# Altium schematic sheet Control.SchDoc
size A4
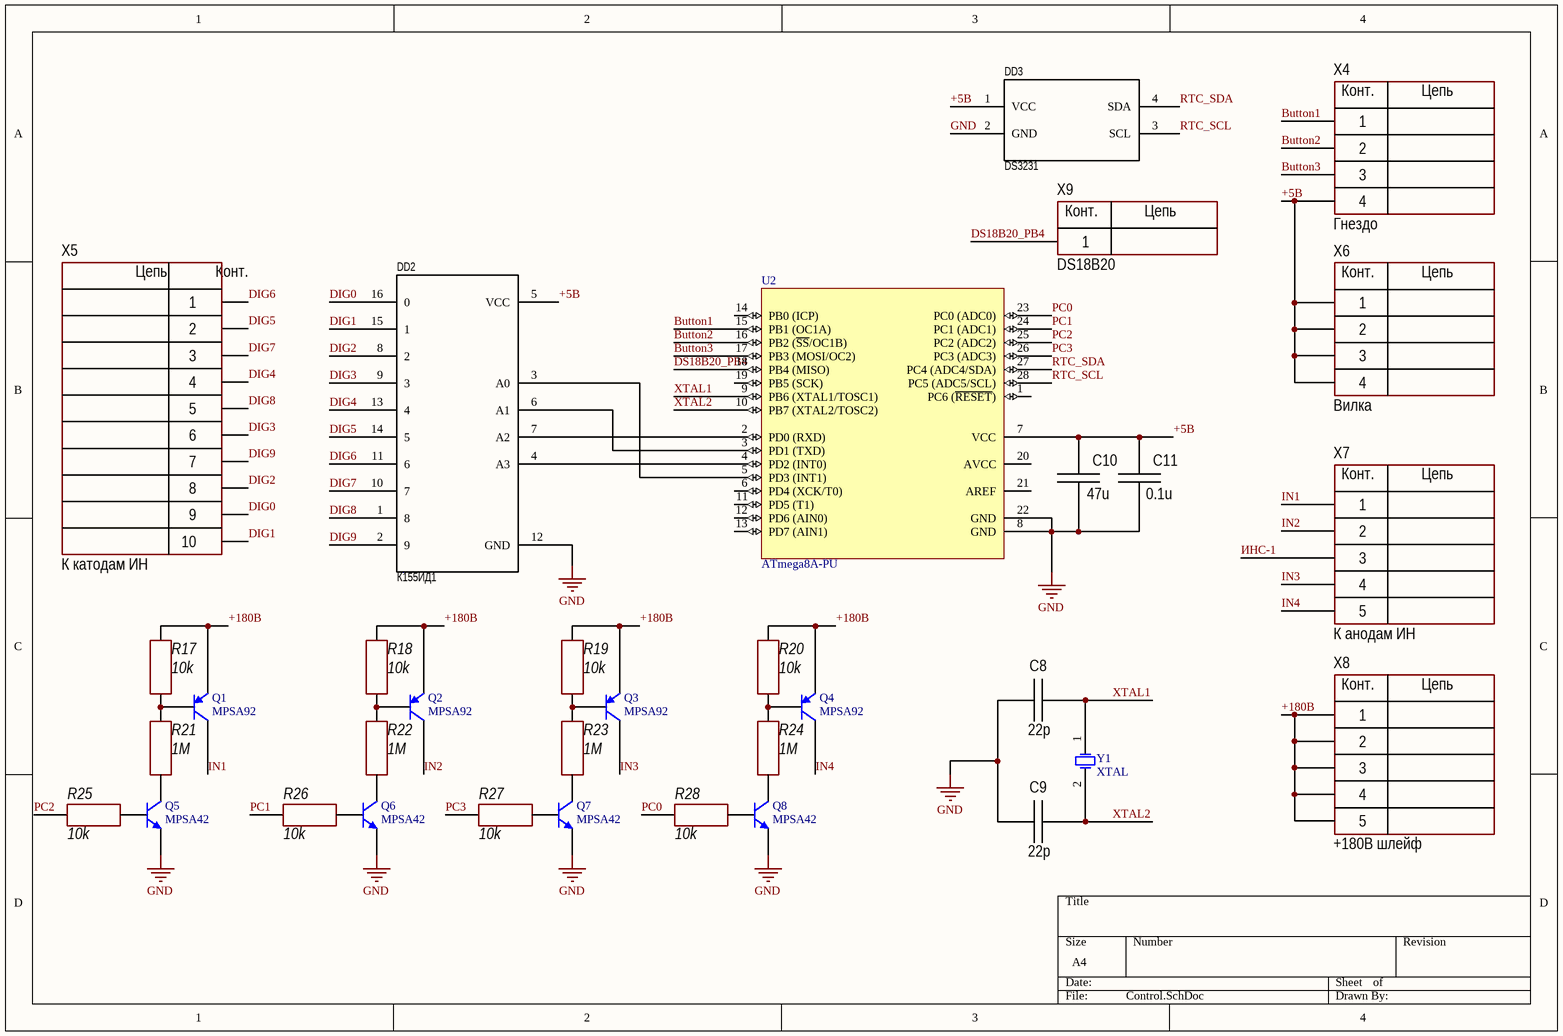
[diagram p0: Control.SchDoc]

## Parts
C8  22p  [CAP: DEBB33D]
C9  22p  [CAP: DEBB33D]
C10  47u  [CAP: DEBB33D]
C11  0.1u  [CAP: DEBB33D]
DD2  К155ИД1  [DIP16]
DD3  DS3231  [DS3231]
Q1  MPSA92  [TO-92A]
Q2  MPSA92  [TO-92A]
Q3  MPSA92  [TO-92A]
Q4  MPSA92  [TO-92A]
Q5  MPSA42  [TO-92A]
Q6  MPSA42  [TO-92A]
Q7  MPSA42  [TO-92A]
Q8  MPSA42  [TO-92A]
R17  10k  [MLT]
R18  10k  [MLT]
R19  10k  [MLT]
R20  10k  [MLT]
R21  1M  [MLT]
R22  1M  [MLT]
R23  1M  [MLT]
R24  1M  [MLT]
R25  10k  [MLT]
R26  10k  [MLT]
R27  10k  [MLT]
R28  10k  [MLT]
U2  ATmega8A-PU  [28P3]
X4  Гнездо  [CON: PBS-4]
X5  К катодам ИН  [CON: PBS-10]
X6  Вилка  [CON: PLS-4]
X7  К анодам ИН  [CON: PBS-5]
X8  +180В шлейф  [CON: PBS-5]
X9  DS18B20  [CON: PADS 1x1mm]
Y1  XTAL  [R38]

## Nets
GND: C8.1 C9.1 C10.2 C11.2 DD2.12(GND) DD3.2(GND) Q5.1(E) Q6.1(E) Q7.1(E) Q8.1(E) U2.8(GND) U2.22(GND)
+5В: C10.1 C11.1 DD2.5(VCC) DD3.1(VCC) U2.7(VCC) X4.4 X6.1 X6.2 X6.3 X6.4
+180В: Q1.1(E) Q2.1(E) Q3.1(E) Q4.1(E) R17.2 R18.2 R19.2 R20.2 X8.1 X8.2 X8.3 X8.4 X8.5
Button1: U2.15(PB1_(OC1A)) X4.1
Button2: U2.16(PB2_(~{SS}/OC1B)) X4.2
Button3: U2.17(PB3_(MOSI/OC2)) X4.3
DIG0: DD2.16(0) X5.9
DIG1: DD2.15(1) X5.10
DIG2: DD2.8(2) X5.8
DIG3: DD2.9(3) X5.6
DIG4: DD2.13(4) X5.4
DIG5: DD2.14(5) X5.2
DIG6: DD2.11(6) X5.1
DIG7: DD2.10(7) X5.3
DIG8: DD2.1(8) X5.5
DIG9: DD2.2(9) X5.7
DS18B20_PB4: U2.18(PB4_(MISO)) X9.1
IN1: Q1.3(C) X7.1
IN2: Q2.3(C) X7.2
IN3: Q3.3(C) X7.4
IN4: Q4.3(C) X7.5
PC0: R28.2 U2.23(PC0_(ADC0))
PC1: R26.2 U2.24(PC1_(ADC1))
PC2: R25.2 U2.25(PC2_(ADC2))
PC3: R27.2 U2.26(PC3_(ADC3))
RTC_SCL: DD3.3(SCL) U2.28(PC5_(ADC5/SCL))
RTC_SDA: DD3.4(SDA) U2.27(PC4_(ADC4/SDA))
XTAL1: C8.2 U2.9(PB6_(XTAL1/TOSC1)) Y1.1(OSC1)
XTAL2: C9.2 U2.10(PB7_(XTAL2/TOSC2)) Y1.2(OSC2)
ИНС-1: X7.3
NetDD2_3: DD2.3(A0) U2.5(PD3_(INT1))
NetDD2_4: DD2.4(A3) U2.4(PD2_(INT0))
NetDD2_6: DD2.6(A1) U2.3(PD1_(TXD))
NetDD2_7: DD2.7(A2) U2.2(PD0_(RXD))
NetQ1_2: Q1.2(B) R17.1 R21.2
NetQ2_2: Q2.2(B) R18.1 R22.2
NetQ3_2: Q3.2(B) R19.1 R23.2
NetQ4_2: Q4.2(B) R20.1 R24.2
NetQ5_2: Q5.2(B) R25.1
NetQ5_3: Q5.3(C) R21.1
NetQ6_2: Q6.2(B) R26.1
NetQ6_3: Q6.3(C) R22.1
NetQ7_2: Q7.2(B) R27.1
NetQ7_3: Q7.3(C) R23.1
NetQ8_2: Q8.2(B) R28.1
NetQ8_3: Q8.3(C) R24.1

Not connected (* = marked no-connect by the designer): U2 1(PC6_(~{RESET})) 6(PD4_(XCK/T0)) 11(PD5_(T1)) 12(PD6_(AIN0)) 13(PD7_(AIN1)) 14(PB0_(ICP)) 19(PB5_(SCK)) 20(AVCC) 21(AREF)

## Notes on the sheet
- (in symbol 1-Connector) Конт.; Цепь
- (in symbol 4-Connector) Конт.; Цепь
- (in symbol 5-Connector) Конт.; Цепь
- (in symbol 10-Connector) Цепь; Конт.

## Library data of the parts
C8-C11 = Capacitor: Manufacturer: *; Model: *; HelpURL: *; ComponentKind: *; Value: *
DD2 = K155ID1
Q1-Q4 = 2N3906: PNP General Purpose Amplifier; Published: 8-Jun-2000; LatestRevisionDate: 15-Jan-2003; LatestRevisionNote: PCB Footprint 'BCY-W3/D4.7' replaced; DatasheetVersion: 1997; PackageVersion: Sep-1998; PackageReference: TO-92A; Publisher: Altium Limited; PackageDescription: TO, Flat Index; 3 In-Line, Axial Leads; Body Dia. 4.5mm; Leads 0.51 x 0.48 mm (max); ComponentLink1Description: Manufacturer Link; ComponentLink1URL: http://www.fairchildsemi.com/; ComponentLink2Description: Datasheet; ComponentLink2URL: http://www.fairchildsemi.com/ds/2N%2F2N3906.pdf
Q5-Q8 = 2N3904: NPN General Purpose Amplifier; Published: 8-Jun-2000; LatestRevisionDate: 15-Jan-2003; LatestRevisionNote: PCB Footprint 'BCY-W3/D4.7' replaced; DatasheetVersion: 1997; PackageVersion: Sep-1998; PackageReference: TO-92A; Publisher: Altium Limited; PackageDescription: TO, Flat Index; 3 In-Line, Axial Leads; Body Dia. 4.5mm; Leads 0.51 x 0.48 mm (max); ComponentLink1Description: Manufacturer Link; ComponentLink1URL: http://www.fairchildsemi.com/; ComponentLink2Description: Datasheet; ComponentLink2URL: http://www.fairchildsemi.com/ds/2N%2F2N3904.pdf
R17-R28 = Resistor: MLT; Model: *; Manufacture: *; HelpURL: *; Case: *; Value: *
U2 = ATmega8A-PU: 8-bit AVR Microcontroller, 8KB Flash, 512 Bytes EEPROM, 1KB SRAM, 28-pin PDIP, Industrial Grade (-40°C to 85°C); Published: 1-Apr-2010; DatasheetVersion: revC, Jul-2009; PackageVersion: revB, Sep-2001; PackageReference: 28P3; Publisher: Altium Limited; PackageDescription: 28-lead (0.300"/7.62mm Wide) Plastic Dual Inline Package (PDIP); Supplier 1: Digi-Key; Supplier Part Number 1: ATMEGA8A-PU-ND; Supplier 2: Farnell; Supplier Part Number 2: 1748534; Supplier 3: Mouser; Supplier Part Number 3: 556-ATMEGA8A-PU; ComponentLink1Description: Manufacturer Link; ComponentLink1URL: http://www.atmel.com/products/avr/default.asp?; ComponentLink2Description: ATmega8A Datasheet; ComponentLink2URL: http://www.atmel.com/dyn/resources/prod_documents/doc8159.pdf; ComponentLink3Description: ATmega8A Summary; ComponentLink3URL: http://www.atmel.com/dyn/resources/prod_documents/8159S.pdf; ComponentLink4Description: Atmel.com Home; ComponentLink4URL: http://www.atmel.com
X4 X6 = 4-Connector: Model: *; Manufacturer: *; HelpURL: *; ComponentKind: *
X5 = 10-Connector: Model: *; Manufacturer: *; HelpURL: *; ComponentKind: *
X7 X8 = 5-Connector: Model: *; Manufacturer: *; HelpURL: *; ComponentKind: *
X9 = 1-Connector: Model: *; Manufacturer: *; HelpURL: *; ComponentKind: *
Y1 = XTAL: Crystal Oscillator; Published: 8-Jun-2000; LatestRevisionDate: 17-Jul-2002; LatestRevisionNote: Re-released for DXP Platform.; PackageReference: R38; Publisher: Altium Limited; PackageDescription: Crystal, Thru-Hole; 2 Leads; Body 3.1 x 8.2 mm (Dia.xH)